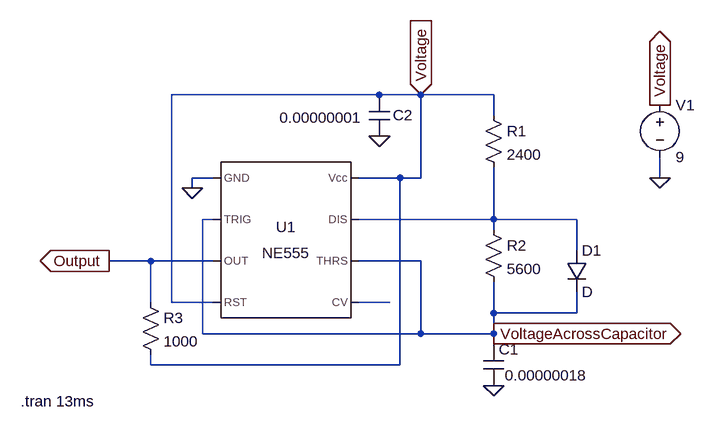
[diagram p0: schematic FreeRunning_Multi-Vibrator.asc]
FreeRunning_Multi-Vibrator.asc, the LTspice schematic file:
Version 4
SHEET 1 880 680
WIRE 336 -48 16 -48
WIRE 400 -48 336 -48
WIRE 512 -48 400 -48
WIRE 512 -16 512 -48
WIRE 80 80 48 80
WIRE 368 80 304 80
WIRE 400 80 400 -48
WIRE 400 80 368 80
WIRE 768 80 768 48
WIRE 48 96 48 80
WIRE 80 144 64 144
WIRE 512 144 512 64
WIRE 512 144 304 144
WIRE 640 144 512 144
WIRE 512 160 512 144
WIRE 640 192 640 144
WIRE -16 208 -80 208
WIRE 80 208 -16 208
WIRE 400 208 304 208
WIRE -16 272 -16 208
WIRE 16 272 16 -48
WIRE 80 272 16 272
WIRE 352 272 304 272
WIRE 512 288 512 240
WIRE 640 288 640 256
WIRE 640 288 512 288
WIRE 64 320 64 144
WIRE 400 320 400 208
WIRE 400 320 64 320
WIRE 512 320 512 288
WIRE 512 320 400 320
WIRE 512 336 512 320
WIRE -16 368 -16 352
WIRE 368 368 368 80
WIRE 368 368 -16 368
FLAG 512 400 0
FLAG 48 96 0
FLAG 400 -48 Voltage
IOPIN 400 -48 In
FLAG 768 80 0
FLAG 768 -32 Voltage
IOPIN 768 -32 Out
FLAG 336 16 0
FLAG -80 208 Output
IOPIN -80 208 Out
FLAG 512 320 VoltageAcrossCapacitor
IOPIN 512 320 Out
SYMBOL Misc\\NE555 192 176 R0
SYMATTR InstName U1
SYMBOL res 496 -32 R0
SYMATTR InstName R1
SYMATTR Value 2400
SYMBOL res 496 144 R0
SYMATTR InstName R2
SYMATTR Value 5600
SYMBOL cap 496 336 R0
WINDOW 3 33 48 Left 2
SYMATTR Value 0.00000018
SYMATTR InstName C1
SYMBOL voltage 768 -48 R0
WINDOW 123 0 0 Left 0
WINDOW 39 0 0 Left 0
SYMATTR InstName V1
SYMATTR Value 9
SYMBOL cap 320 -48 R0
WINDOW 0 37 31 Left 2
WINDOW 3 -138 35 Left 2
SYMATTR InstName C2
SYMATTR Value 0.00000001
SYMBOL res -32 256 R0
SYMATTR InstName R3
SYMATTR Value 1000
SYMBOL diode 624 192 R0
SYMATTR InstName D1
TEXT -216 424 Left 2 !.tran 13ms

The netlist it stands for:
* FreeRunning_Multi-Vibrator.asc
XU1 0 VoltageAcrossCapacitor Output Voltage N002 VoltageAcrossCapacitor N001 Voltage NE555  ; pins GND TRIG OUT RST CV THRS DIS Vcc
R1 Voltage N001 2400
R2 N001 VoltageAcrossCapacitor 5600
C1 VoltageAcrossCapacitor 0 0.00000018
V1 Voltage 0 9
C2 Voltage 0 0.00000001
R3 Output Voltage 1000
D1 N001 VoltageAcrossCapacitor D
.model D D
.lib standard.dio
.tran 13ms
.lib NE555.sub
.backanno
.end